# Altium project uVNA.PrjPcb (part 2 of 2)

## Sheet CodecA.SchDoc
size A4; SheetNumber: 10; SheetTotal: 14
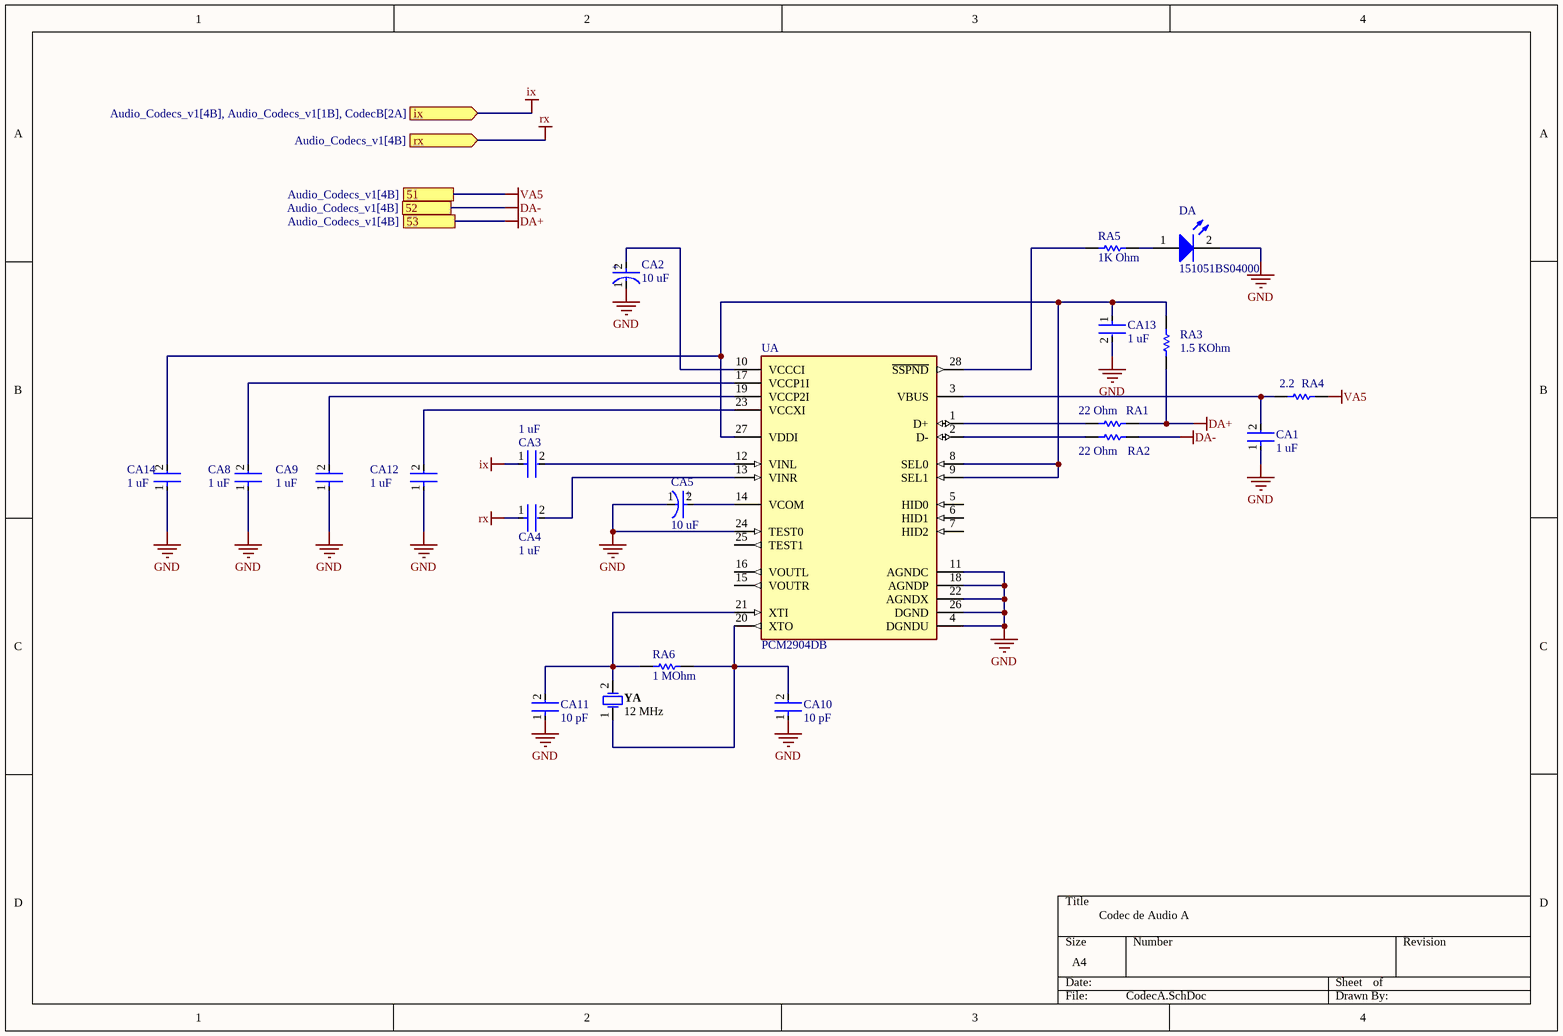
[diagram p10: CodecA.SchDoc]

### Parts
CA1  1 uF  [FP-CC0805-0_85-MFG]
CA2  10 uF  [FP-RAD-TH-D_6_3_0_5-L_7_1-MFG]
CA3  1 uF  [FP-CC0805-0_85-MFG]
CA4  1 uF  [FP-CC0805-0_85-MFG]
CA5  10 uF  [FP-RAD-TH-D_6_3_0_5-L_7_1-MFG]
CA8  1 uF  [FP-CC0805-0_85-MFG]
CA9  1 uF  [FP-CC0805-0_85-MFG]
CA10  10 pF  [FP-CC0805-0_85-MFG]
CA11  10 pF  [FP-CC0805-0_85-MFG]
CA12  1 uF  [FP-CC0805-0_85-MFG]
CA13  1 uF  [FP-CC0805-0_85-MFG]
CA14  1 uF  [FP-CC0805-0_85-MFG]
DA  151051BS04000  [WL-TMRC_D5.9H8.7]
RA1  22 Ohm  [RESC2013X60X40ML20T25]
RA2  22 Ohm  [RESC2013X60X40ML20T25]
RA3  1.5 KOhm  [RESC2013X60X40ML20T25]
RA4  2.2  [RESC2013X60X40ML20T25]
RA5  1K Ohm  [RESC2013X60X40ML20T25]
RA6  1 MOhm  [RESC2013X60X40ML20T25]
UA  PCM2904DB  [FP-DB0028A-IPC_A]
YA  12 MHz  [FOX-FOXSLF160-20]

### Ports
51 (see Audio_Codecs_v1[4B]), 52 (see Audio_Codecs_v1[4B]), 53 (see Audio_Codecs_v1[4B]), ix (in, see Audio_Codecs_v1[4B], Audio_Codecs_v1[1B], CodecB[2A]), rx (in, see Audio_Codecs_v1[4B])

### Nets
DA+: RA1.1 RA3.2 RA4.1 ; port 51, port 53  [also labelled VA5]
DA-: RA2.2 ; port 52
GND: CA1.1 CA2.1(C) CA5.1(C) CA8.1 CA9.1 CA10.1 CA11.1 CA12.1 CA13.2 CA14.1 DA.2(K) UA.4(DGNDU) UA.11(AGNDC) UA.18(AGNDP) UA.22(AGNDX) UA.24(TEST0) UA.26(DGND)
ix: CA3.1 ; port ix  [project net IF1]
rx: CA4.1 ; port rx
NetCA1_2: CA1.2 RA4.2 UA.3(VBUS)
NetCA2_2: CA2.2(A) UA.10(VCCCI)
NetCA3_2: CA3.2 UA.12(VINL)
NetCA4_2: CA4.2 UA.13(VINR)
NetCA5_2: CA5.2(A) UA.14(VCOM)
NetCA8_2: CA8.2 UA.17(VCCP1I)
NetCA9_2: CA9.2 UA.19(VCCP2I)
NetCA10_2: CA10.2 RA6.2 UA.20(XTO) YA.1
NetCA11_2: CA11.2 RA6.1 UA.21(XTI) YA.2
NetCA12_2: CA12.2 UA.23(VCCXI)
NetCA13_1: CA13.1 CA14.2 RA3.1 UA.8(SEL0) UA.9(SEL1) UA.27(VDDI)
NetDA_1: DA.1(A) RA5.1
NetRA1_2: RA1.2 UA.1(D+)
NetRA2_1: RA2.1 UA.2(D-)
NetRA5_2: RA5.2 UA.28(~{SSPND})

Not connected (* = marked no-connect by the designer): UA 5(HID0) 6(HID1) 7(HID2) 15(VOUTR) 16(VOUTL) 25(TEST1)

### Notes on the sheet
- Codec de Audio A
- (in symbol CMP-05427-001316-1) +

### Library data of the parts
CA1 CA3 CA4 CA8-CA14 = CMP-2100-03606-3: CAP CER 0.1UF 50V X7R 0805; Manufacturer Part Number: CC0805KRX7R9BB104; Manufacturer: Yageo; Tolerance: 0.1; Capacitance: 100 nF; Value: 100 nF; Device Class L1: Passive Components; ComponentLink2Description: Datasheet; Package: CC0805-0.85; Digikey Description: CAP CER 0.1UF 50V X7R 0805; Device Class L3: Ceramic Capacitors; Temperature: -30°C to +85°C; Temperature Characteristic: X7R; Voltage Rating: 50 V; Height: 0.95mm; RoHS: TRUE; Ipc Land Pattern Name: CAPC200125X85; Device Class L2: Capacitors; Category: Cap; Temperature Range Low: -30°C; Temperature Range High: +85°C; Material: Ceramic; Mouser Description: Multilayer Ceramic Capacitors MLCC - SMD/SMT 100nF 50V X7R 10%; Footprint Url: http://www.yageo.com/exep/pages/download/literatures/UPY-C_GEN_24.pdf; Automotive: No; Octopart: https://octopart.com/cc0805krx7r9bb104-yageo-192993; Lead Free: Yes; ComponentLink2URL: http://www.yageo.com/documents/recent/UPY-GPHC_Y5V_6.3V-to-50V_8.pdf
CA2 CA5 = CMP-05427-001316-1: Aluminum Electrolytic Capacitors (Radial Lead Type) 100uF ±20% 16V; Life (Hours): 1000Hour; Lead Diameter: 0.45mm; Polarity: Polar; Ripple Current: 91mA; Series: KA; Packaging: Tape and Reel; Voltage Rating: 16V; Voltage Rating (DC): 16V; Min Operating Temperature: -40°C; Lead Pitch: 2.5mm; Mount: Through Hole; Height - Seated (Max): 0.315inch; Package Quantity: 2000; Length: 7mm; Termination: Radial; Voltage: 16V; Diameter: 6.3mm; Height: 7mm; Radiation Hardening: No; RoHS Compliant: Yes; Tolerance: 20%; Capacitance: 100uF; Case/Package: Radial; Max Operating Temperature: 85°C
DA = CMP-1488-00009-2: NexarPartId: 29717812; Test Current: 20mA; Forward Voltage: 3.2V; Wavelength: 470nm; Lens Size: 5mm; Lens Style: Circular, Diffused, Round; Forward Current: 100mA; Peak Wavelength: 465nm; Viewing Angle: 40°; Luminous Intensity: 500mcd; Max Reverse Voltage (DC): 5V; Case/Package: Radial; Width: 5mm; Mount: Through Hole; Min Operating Temperature: -40°C; Length: 5mm; Height: 8.6mm; Max Operating Temperature: 85°C; Packaging: Bulk; Color: Blue; RoHS: Compliant; REACH SVHC: Unknown; Dominant Wavelength: 470nm
RA1-RA6 = CMP-2001-00580-1: Manufacturer: Panasonic; Part Number: ERA6AEB101V
UA = CMP-04873-000006-1: IC STEREO AUD CODEC W/USB 28SSOP; Max Supply Voltage: 5.25V; Number of Analog Outputs: 2; Operating Supply Voltage: 5V; Number of A/D Converters: 1; Min Supply Voltage: 3.25V; Resolution: 16b; Nominal Supply Current: 67mA; Number of Bits: 16; Sampling Rate: 48KS/s; Signal to Noise Ratio (SNR): 89dB; Interface: USB; Width: 5.3mm; Length: 10.2mm; Radiation Hardening: No; Weight: 0.010081oz; Height: 1.95mm; Mount: Surface Mount; Number of Analog Inputs: 2; RoHS Compliant: Yes; Lead Free: Lead Free; Number of DAC Channels: 2; Max Operating Temperature: 85°C; Number of Channels: 2; Number of Pins: 28; Packaging: Rail/Tube; Case/Package: SSOP; Number of ADC Channels: 2; Number of D/A Converters: 1; Min Operating Temperature: -25°C; Package Quantity: 47; Type: General Purpose
YA = CMP-1749-00003-1: Resistance Weld Thru-Hole Crystal, 16 MHz, -20 to 70 degC, 2-Pin THD, RoHS, Bulk; Voltage Rating: 250 V; Tolerance: 1%; Resistance: 221 kohm; Case\Package: Axial; Power Rating: 250 mW; RoHSCompliant: true; Package Quantity: 200; Packaging: Bulk; Min Operating Temperature: -55 degC; DatasheetVersion: Mar-15; ComponentLink1URL: http://www.foxonline.com/; Max Operating Temperature: 155 degC; PackageReference: FOXSLF160-20; Mount: Through Hole; PackageDescription: 2-Pin Through Hole Device, Body 11.35 x 4.65 mm; ComponentLink1Description: Manufacturer URL; ComponentLink2URL: http://www.foxonline.com/pdfs/hc49slf.pdf; ComponentLink2Description: Datasheet; Length: 0.248 inch

## Sheet CodecB.SchDoc
size A4; SheetNumber: 11; SheetTotal: 14
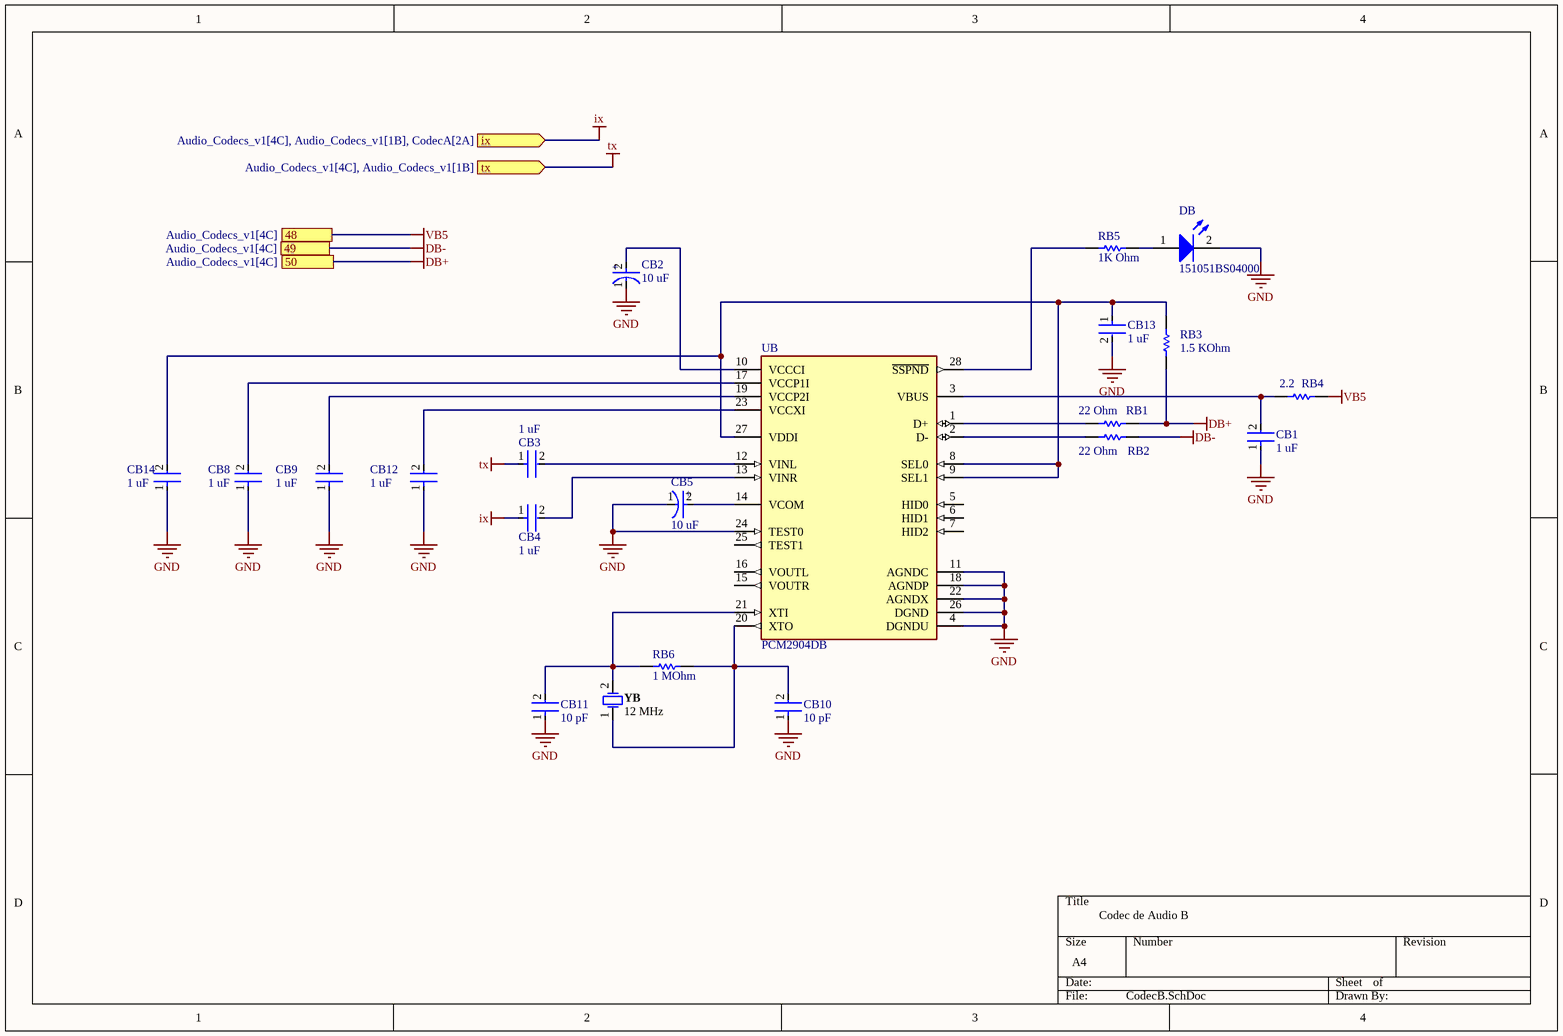
[diagram p11: CodecB.SchDoc]

### Parts
CB1  1 uF  [FP-CC0805-0_85-MFG]
CB2  10 uF  [FP-RAD-TH-D_6_3_0_5-L_7_1-MFG]
CB3  1 uF  [FP-CC0805-0_85-MFG]
CB4  1 uF  [FP-CC0805-0_85-MFG]
CB5  10 uF  [FP-RAD-TH-D_6_3_0_5-L_7_1-MFG]
CB8  1 uF  [FP-CC0805-0_85-MFG]
CB9  1 uF  [FP-CC0805-0_85-MFG]
CB10  10 pF  [FP-CC0805-0_85-MFG]
CB11  10 pF  [FP-CC0805-0_85-MFG]
CB12  1 uF  [FP-CC0805-0_85-MFG]
CB13  1 uF  [FP-CC0805-0_85-MFG]
CB14  1 uF  [FP-CC0805-0_85-MFG]
DB  151051BS04000  [WL-TMRC_D5.9H8.7]
RB1  22 Ohm  [RESC2013X60X40ML20T25]
RB2  22 Ohm  [RESC2013X60X40ML20T25]
RB3  1.5 KOhm  [RESC2013X60X40ML20T25]
RB4  2.2  [RESC2013X60X40ML20T25]
RB5  1K Ohm  [RESC2013X60X40ML20T25]
RB6  1 MOhm  [RESC2013X60X40ML20T25]
UB  PCM2904DB  [FP-DB0028A-IPC_A]
YB  12 MHz  [FOX-FOXSLF160-20]

### Ports
48 (see Audio_Codecs_v1[4C]), 49 (see Audio_Codecs_v1[4C]), 50 (see Audio_Codecs_v1[4C]), ix (in, see Audio_Codecs_v1[4C], Audio_Codecs_v1[1B], CodecA[2A]), tx (in, see Audio_Codecs_v1[4C], Audio_Codecs_v1[1B])

### Nets
DB+: RB1.1 RB3.2 ; port 50
DB-: RB2.2 ; port 49
GND: CB1.1 CB2.1(C) CB5.1(C) CB8.1 CB9.1 CB10.1 CB11.1 CB12.1 CB13.2 CB14.1 DB.2(K) UB.4(DGNDU) UB.11(AGNDC) UB.18(AGNDP) UB.22(AGNDX) UB.24(TEST0) UB.26(DGND)
ix: CB4.1 ; port ix  [project net IF1]
tx: CB3.1 ; port tx  [project net IF4]
VB5: RB4.1 ; port 48
NetCB1_2: CB1.2 RB4.2 UB.3(VBUS)
NetCB2_2: CB2.2(A) UB.10(VCCCI)
NetCB3_2: CB3.2 UB.12(VINL)
NetCB4_2: CB4.2 UB.13(VINR)
NetCB5_2: CB5.2(A) UB.14(VCOM)
NetCB8_2: CB8.2 UB.17(VCCP1I)
NetCB9_2: CB9.2 UB.19(VCCP2I)
NetCB10_2: CB10.2 RB6.2 UB.20(XTO) YB.1
NetCB11_2: CB11.2 RB6.1 UB.21(XTI) YB.2
NetCB12_2: CB12.2 UB.23(VCCXI)
NetCB13_1: CB13.1 CB14.2 RB3.1 UB.8(SEL0) UB.9(SEL1) UB.27(VDDI)
NetDB_1: DB.1(A) RB5.1
NetRB1_2: RB1.2 UB.1(D+)
NetRB2_1: RB2.1 UB.2(D-)
NetRB5_2: RB5.2 UB.28(~{SSPND})

Not connected (* = marked no-connect by the designer): UB 5(HID0) 6(HID1) 7(HID2) 15(VOUTR) 16(VOUTL) 25(TEST1)

### Notes on the sheet
- Codec de Audio B
- (in symbol CMP-05427-001316-1) +

### Library data of the parts
CB1 CB3 CB4 CB8-CB14 = CMP-2100-03606-3: as CA1 on sheet CodecA; Device Class L1: Passive Components; ComponentLink2Description: Datasheet; Package: CC0805-0.85; Digikey Description: CAP CER 0.1UF 50V X7R 0805; Device Class L3: Ceramic Capacitors; Temperature: -30°C to +85°C; Temperature Characteristic: X7R; Voltage Rating: 50 V; Height: 0.95mm; RoHS: TRUE; Ipc Land Pattern Name: CAPC200125X85; Device Class L2: Capacitors; Category: Cap; Temperature Range Low: -30°C; Temperature Range High: +85°C; Material: Ceramic; Mouser Description: Multilayer Ceramic Capacitors MLCC - SMD/SMT 100nF 50V X7R 10%; Footprint Url: http://www.yageo.com/exep/pages/download/literatures/UPY-C_GEN_24.pdf; Automotive: No; Octopart: https://octopart.com/cc0805krx7r9bb104-yageo-192993; Lead Free: Yes; ComponentLink2URL: http://www.yageo.com/documents/recent/UPY-GPHC_Y5V_6.3V-to-50V_8.pdf
CB2 CB5 = CMP-05427-001316-1: as CA2 on sheet CodecA; Series: KA; Packaging: Tape and Reel; Voltage Rating: 16V; Voltage Rating (DC): 16V; Min Operating Temperature: -40°C; Lead Pitch: 2.5mm; Mount: Through Hole; Height - Seated (Max): 0.315inch; Package Quantity: 2000; Length: 7mm; Termination: Radial; Voltage: 16V; Diameter: 6.3mm; Height: 7mm; Radiation Hardening: No; RoHS Compliant: Yes; Tolerance: 20%; Capacitance: 100uF; Case/Package: Radial; Max Operating Temperature: 85°C
DB = CMP-1488-00009-2: as DA on sheet CodecA; Case/Package: Radial; Width: 5mm; Mount: Through Hole; Min Operating Temperature: -40°C; Length: 5mm; Height: 8.6mm; Max Operating Temperature: 85°C; Packaging: Bulk; Color: Blue; RoHS: Compliant; REACH SVHC: Unknown; Dominant Wavelength: 470nm
RB1-RB6 = CMP-2001-00580-1: as RA1 on sheet CodecA
UB = CMP-04873-000006-1: as UA on sheet CodecA; Width: 5.3mm; Length: 10.2mm; Radiation Hardening: No; Weight: 0.010081oz; Height: 1.95mm; Mount: Surface Mount; Number of Analog Inputs: 2; RoHS Compliant: Yes; Lead Free: Lead Free; Number of DAC Channels: 2; Max Operating Temperature: 85°C; Number of Channels: 2; Number of Pins: 28; Packaging: Rail/Tube; Case/Package: SSOP; Number of ADC Channels: 2; Number of D/A Converters: 1; Min Operating Temperature: -25°C; Package Quantity: 47; Type: General Purpose
YB = CMP-1749-00003-1: as YA on sheet CodecA; RoHSCompliant: true; Package Quantity: 200; Packaging: Bulk; Min Operating Temperature: -55 degC; DatasheetVersion: Mar-15; ComponentLink1URL: http://www.foxonline.com/; Max Operating Temperature: 155 degC; PackageReference: FOXSLF160-20; Mount: Through Hole; PackageDescription: 2-Pin Through Hole Device, Body 11.35 x 4.65 mm; ComponentLink1Description: Manufacturer URL; ComponentLink2URL: http://www.foxonline.com/pdfs/hc49slf.pdf; ComponentLink2Description: Datasheet; Length: 0.248 inch

## Sheet PIC18F4550.SchDoc
size A4; SheetNumber: 5; SheetTotal: 13
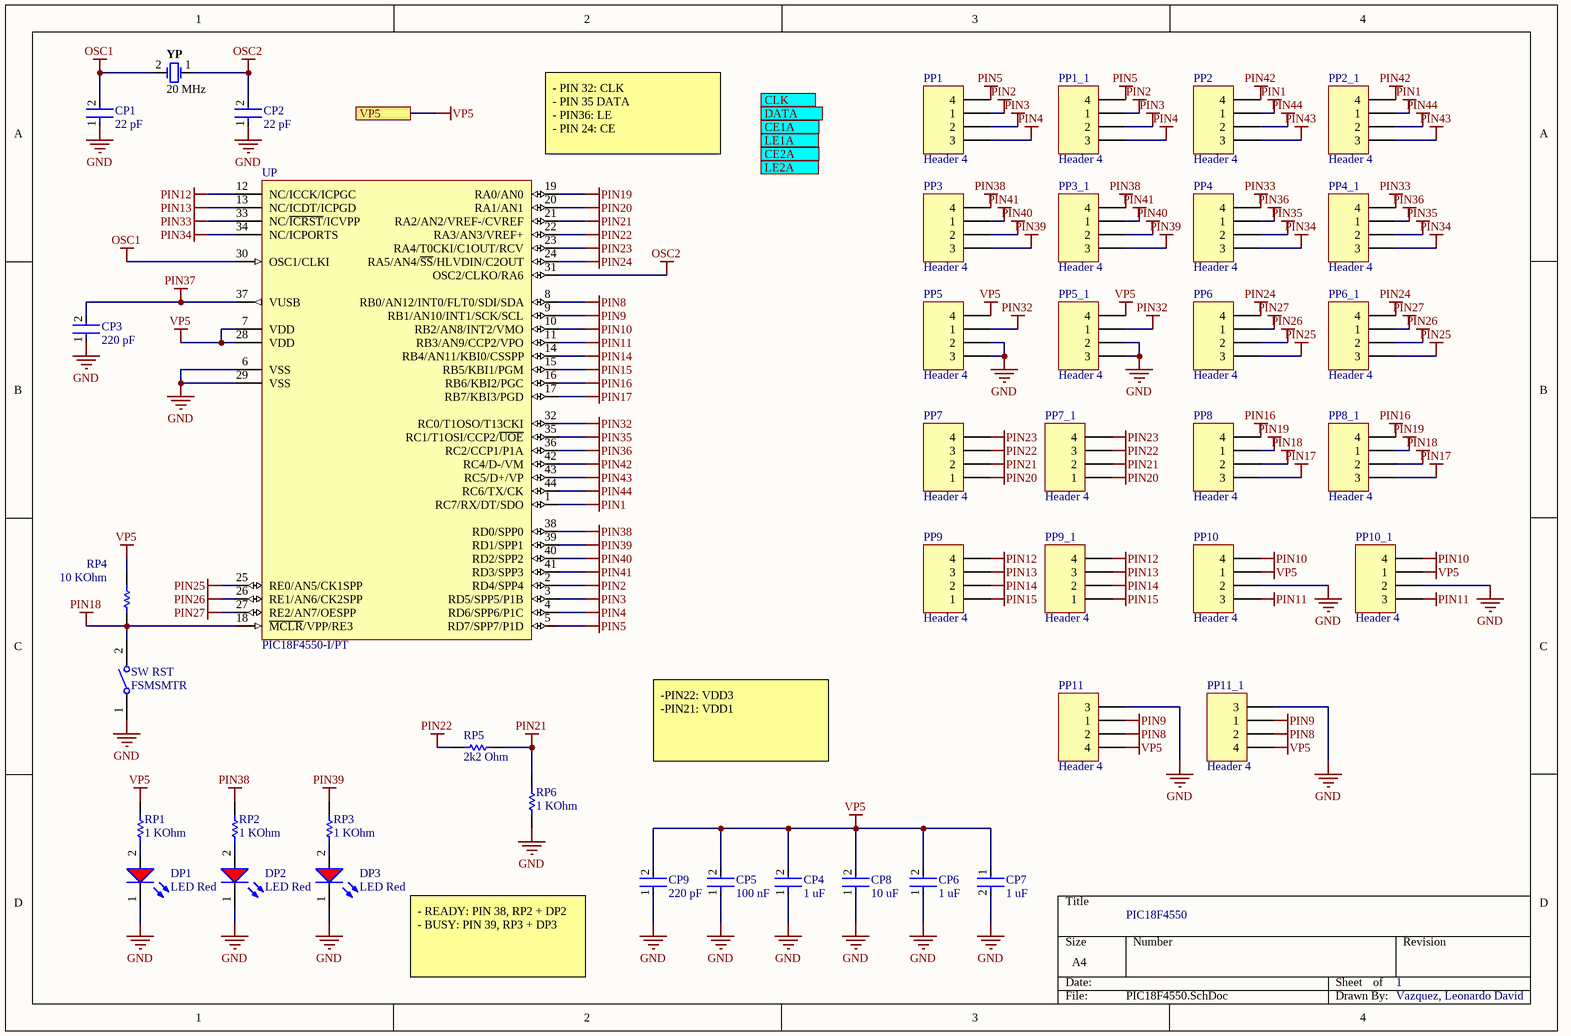
[diagram p12: PIC18F4550.SchDoc]

### Parts
CP1  22 pF  [FP-CC0805-0_85-MFG]
CP2  22 pF  [FP-CC0805-0_85-MFG]
CP3  220 pF  [FP-CC0805-0_85-MFG]
CP4  1 uF  [FP-CC0805-0_85-MFG]
CP5  100 nF  [FP-CC0805-0_85-MFG]
CP6  1 uF  [FP-CC0805-0_85-MFG]
CP7  1 uF  [FP-CC0805-0_85-MFG]
CP8  10 uF  [FP-CC0805-0_85-MFG]
CP9  220 pF  [FP-CC0805-0_85-MFG]
DP1  LED Red  [WL-SMCW_0805_150080xx75000]
DP2  LED Red  [WL-SMCW_0805_150080xx75000]
DP3  LED Red  [WL-SMCW_0805_150080xx75000]
PP1  Header 4  [HDR1X4]
PP1_1  Header 4  [HDR1X4]
PP2  Header 4  [HDR1X4]
PP2_1  Header 4  [HDR1X4]
PP3  Header 4  [HDR1X4]
PP3_1  Header 4  [HDR1X4]
PP4  Header 4  [HDR1X4]
PP4_1  Header 4  [HDR1X4]
PP5  Header 4  [HDR1X4]
PP5_1  Header 4  [HDR1X4]
PP6  Header 4  [HDR1X4]
PP6_1  Header 4  [HDR1X4]
PP7  Header 4  [HDR1X4]
PP7_1  Header 4  [HDR1X4]
PP8  Header 4  [HDR1X4]
PP8_1  Header 4  [HDR1X4]
PP9  Header 4  [HDR1X4]
PP9_1  Header 4  [HDR1X4]
PP10  Header 4  [HDR1X4]
PP10_1  Header 4  [HDR1X4]
PP11  Header 4  [HDR1X4]
PP11_1  Header 4  [HDR1X4]
RP1  1 KOhm  [RESC2013X60X40ML20T25]
RP2  1 KOhm  [RESC2013X60X40ML20T25]
RP3  1 KOhm  [RESC2013X60X40ML20T25]
RP4  10 KOhm  [RESC2013X60X40ML20T25]
RP5  2k2 Ohm  [RESC2013X60X40ML20T25]
RP6  1 KOhm  [RESC2013X60X40ML20T25]
SW_RST  FSMSMTR  [TECO-FSMSMTR_V]
UP  PIC18F4550-I/PT  [TQFP-PT44_M]
YP  20 MHz  [FOX-FOXSLF160-20]

### Ports
CE1A (out, see uVNA[1B], ADF4351_10X2_v1[1D], Data_converter[1A]), CE2A (out, see uVNA[1B], ADF4351_10X2_v1[1D], Data_converter[3A]), CLK (out, see uVNA[1B], ADF4351_10X2_v1[1D]), DATA (out, see uVNA[1B], ADF4351_10X2_v1[1D]), LE1A (out, see uVNA[1B], ADF4351_10X2_v1[1D], Data_converter[1C]), LE2A (out, see uVNA[1B], ADF4351_10X2_v1[1D], Data_converter[3C]), VP5 (see uVNA[1A])

### Nets
GND: CP1.1 CP2.1 CP3.1 CP4.1 CP5.1 CP6.1 CP7.2 CP8.1 CP9.1 DP1.1(K) DP2.1(K) DP3.1(K) PP5.2 PP5.3 PP5_1.2 PP5_1.3 PP10.2 PP10_1.2 PP11.3 PP11_1.3 RP6.1 SW_RST.1 UP.6(VSS) UP.29(VSS)
OSC1: CP1.2 UP.30(OSC1/CLKI) YP.2
OSC2: CP2.2 UP.31(OSC2/CLKO/RA6) YP.1
PIN1: PP2.1 PP2_1.1 UP.1(RC7/RX/DT/SDO)
PIN2: PP1.1 PP1_1.1 UP.2(RD4/SPP4)
PIN3: PP1.2 PP1_1.2 UP.3(RD5/SPP5/P1B)
PIN4: PP1.3 PP1_1.3 UP.4(RD6/SPP6/P1C)
PIN5: PP1.4 PP1_1.4 UP.5(RD7/SPP7/P1D)
PIN8: PP11.2 PP11_1.2 UP.8(RB0/AN12/INT0/FLT0/SDI/SDA)
PIN9: PP11.1 PP11_1.1 UP.9(RB1/AN10/INT1/SCK/SCL)
PIN10: PP10.4 PP10_1.4 UP.10(RB2/AN8/INT2/VMO)
PIN11: PP10.3 PP10_1.3 UP.11(RB3/AN9/CCP2/VPO)
PIN12: PP9.4 PP9_1.4 UP.12(NC/ICCK/ICPGC)
PIN13: PP9.3 PP9_1.3 UP.13(NC/ICDT/ICPGD)
PIN14: PP9.2 PP9_1.2 UP.14(RB4/AN11/KBI0/CSSPP)
PIN15: PP9.1 PP9_1.1 UP.15(RB5/KBI1/PGM)
PIN16: PP8.4 PP8_1.4 UP.16(RB6/KBI2/PGC)
PIN17: PP8.3 PP8_1.3 UP.17(RB7/KBI3/PGD)
PIN18: PP8.2 PP8_1.2 RP4.1 SW_RST.2 UP.18(~{MCLR}/VPP/RE3)
PIN19: PP8.1 PP8_1.1 UP.19(RA0/AN0)
PIN20: PP7.1 PP7_1.1 UP.20(RA1/AN1)
PIN21: PP7.2 PP7_1.2 RP5.1 RP6.2 UP.21(RA2/AN2/VREF-/CVREF)
PIN22: PP7.3 PP7_1.3 RP5.2 UP.22(RA3/AN3/VREF+)
PIN23: PP7.4 PP7_1.4 UP.23(RA4/T0CKI/C1OUT/RCV)
PIN24: PP6.4 PP6_1.4 UP.24(RA5/AN4/~{SS}/HLVDIN/C2OUT)
PIN25: PP6.3 PP6_1.3 UP.25(RE0/AN5/CK1SPP)
PIN26: PP6.2 PP6_1.2 UP.26(RE1/AN6/CK2SPP)
PIN27: PP6.1 PP6_1.1 UP.27(RE2/AN7/OESPP)
PIN32: PP5.1 PP5_1.1 UP.32(RC0/T1OSO/T13CKI)
PIN33: PP4.4 PP4_1.4 UP.33(NC/~{ICRST}/ICVPP)
PIN34: PP4.3 PP4_1.3 UP.34(NC/ICPORTS)
PIN35: PP4.2 PP4_1.2 UP.35(RC1/T1OSI/CCP2/~{UOE})
PIN36: PP4.1 PP4_1.1 UP.36(RC2/CCP1/P1A)
PIN37: CP3.2 UP.37(VUSB)
PIN38: PP3.4 PP3_1.4 RP2.2 UP.38(RD0/SPP0)
PIN39: PP3.3 PP3_1.3 RP3.2 UP.39(RD1/SPP1)
PIN40: PP3.2 PP3_1.2 UP.40(RD2/SPP2)
PIN41: PP3.1 PP3_1.1 UP.41(RD3/SPP3)
PIN42: PP2.4 PP2_1.4 UP.42(RC4/D-/VM)
PIN43: PP2.3 PP2_1.3 UP.43(RC5/D+/VP)
PIN44: PP2.2 PP2_1.2 UP.44(RC6/TX/CK)
VP5: CP4.2 CP5.2 CP6.2 CP7.1 CP8.2 CP9.2 PP5.4 PP5_1.4 PP10.1 PP10_1.1 PP11.4 PP11_1.4 RP1.2 RP4.2 UP.7(VDD) UP.28(VDD) ; port VP5
NetDP1_2: DP1.2(A) RP1.1
NetDP2_2: DP2.2(A) RP2.1
NetDP3_2: DP3.2(A) RP3.1

### Notes on the sheet
- (near UP) - PIN 32: CLK
  - PIN 35 DATA
  - PIN36: LE
  - PIN 24: CE
- -PIN22: VDD3
  -PIN21: VDD1
- PIC18F4550
- - READY: PIN 38, RP2 + DP2
  - BUSY: PIN 39, RP3 + DP3
- 1
- Vazquez, Leonardo David

### Library data of the parts
CP1-CP4 CP6-CP9 = CMP-2100-03606-3: as CA1 on sheet CodecA; Device Class L1: Passive Components; ComponentLink2Description: Datasheet; Package: CC0805-0.85; Digikey Description: CAP CER 0.1UF 50V X7R 0805; Device Class L3: Ceramic Capacitors; Temperature: -30°C to +85°C; Temperature Characteristic: X7R; Voltage Rating: 50 V; Height: 0.95mm; RoHS: TRUE; Ipc Land Pattern Name: CAPC200125X85; Device Class L2: Capacitors; Category: Cap; Temperature Range Low: -30°C; Temperature Range High: +85°C; Material: Ceramic; Mouser Description: Multilayer Ceramic Capacitors MLCC - SMD/SMT 100nF 50V X7R 10%; Footprint Url: http://www.yageo.com/exep/pages/download/literatures/UPY-C_GEN_24.pdf; Automotive: No; Octopart: https://octopart.com/cc0805krx7r9bb104-yageo-192993; Lead Free: Yes; ComponentLink2URL: http://www.yageo.com/documents/recent/UPY-GPHC_Y5V_6.3V-to-50V_8.pdf
CP5 = CMP-2100-03606-3: CAP CER 0.1UF 50V X7R 0805; Manufacturer Part Number: CC0805KRX7R9BB104; Manufacturer: Yageo; Tolerance: 0.1; Device Class L1: Passive Components; ComponentLink2Description: Datasheet; Package: CC0805-0.85; Digikey Description: CAP CER 0.1UF 50V X7R 0805; Capacitance: 100 nF; Device Class L3: Ceramic Capacitors; Value: 100 nF; Temperature: -30°C to +85°C; Temperature Characteristic: X7R; Voltage Rating: 50 V; Height: 0.95mm; RoHS: TRUE; Ipc Land Pattern Name: CAPC200125X85; Device Class L2: Capacitors; Category: Cap; Temperature Range Low: -30°C; Temperature Range High: +85°C; Material: Ceramic; Mouser Description: Multilayer Ceramic Capacitors MLCC - SMD/SMT 100nF 50V X7R 10%; Footprint Url: http://www.yageo.com/exep/pages/download/literatures/UPY-C_GEN_24.pdf; Automotive: No; Octopart: https://octopart.com/cc0805krx7r9bb104-yageo-192993; Lead Free: Yes; ComponentLink2URL: http://www.yageo.com/documents/recent/UPY-GPHC_Y5V_6.3V-to-50V_8.pdf
DP1-DP3 = CMP-1426-00011-2: NexarPartId: 29717781; Peak Wavelength: 630nm; Wavelength: 625nm; Viewing Angle: 140°; Test Current: 20mA; Forward Voltage: 2V; Forward Current: 100mA; Lens Style: Clear, Rectangular; Luminous Intensity: 150mcd; Max Reverse Voltage (DC): 5V; Length: 2mm; Case Code (Imperial): 0805; RoHS: Compliant; Max Operating Temperature: 85°C; Height: 700µm; Packaging: Tape and Reel; Color: Red; Case/Package: 0805; REACH SVHC: Unknown; Dominant Wavelength: 625nm; Min Operating Temperature: -40°C; Case Code (Metric): 2012; Mount: Surface Mount; Width: 1.25mm
PP1 PP1_1 PP2 PP2_1 PP3 PP3_1 PP4 PP4_1 PP5 PP5_1 PP6 PP6_1 PP7 PP7_1 PP8 PP8_1 PP9 PP9_1 PP10 PP10_1 PP11 PP11_1 = Header 4: Header, 4-Pin; LatestRevisionDate: 17-Jul-2002; LatestRevisionNote: Re-released for DXP Platform.; Publisher: Altium Limited
RP1-RP6 = CMP-2001-00580-1: as RA1 on sheet CodecA
SW_RST = CMP-2000-07501-1: FSMSM Push Button Switch, 50 mA, -35 to 85 degC, 2-Pin SMD, RoHS, Tape and Reel; Manufacturer: TE Connectivity; Voltage Rating (DC): 24V; Electrical Life: 20000Cycles; Operating Force: 180gf; Switch Travel: 0.25mm; Contact Current Rating: 50mA; Case\/Package: SMD/SMT; Actuator Length: 1.07mm; Throw Configuration: SPST; Actuator Material: Polyamide; Contact Resistance: 100mOhm; Illumination Type: Illuminated; Max Voltage Rating (DC): 12V; Manufacturer URL: http://www.te.com/; Lead Free: LeadFree; Packaging: TapeandReel; Min Operating Temperature: -35degC; Mechanical Life: 20000Cycles; Mount: SurfaceMount; REACH SVHC: Unknown; Package Quantity: 1800; Package Reference: FSMSMTR; RoHSCompliant: true; Max Operating Temperature: 85degC; Orientation: Straight; ELV: Compliant; Datasheet URL: http://www.te.com/commerce/DocumentDelivery/DDEController?Action=showdoc&DocId=Customer+Drawing%7F1437566-3%7FC2%7Fpdf%7FEnglish%7FENG_CD_1437566-3_C2_1437566_3_1_c.dwg.pdf%7F1437566-4; Package Description: 2-Pin Surface Mount Device, Body 6 x 3.5 mm, Pitch 9.19 mm; Current Rating: 50mA; Contact Plating: Silver; Termination: GullWing; Datasheet Version: Rev. C2, 08/2014; Contact Material: Brass; Mounting Technology: SurfaceMount
UP = CMP-0116-00956-1: High Performance, Enhanced Flash, USB Microcontroller with nanoWatt Technology, 32K Flash, 44-Pin TQFP, Industrial Temperature Range; Code_JEDEC: MS-026; PackageReference: TQFP-PT44; DatasheetVersion: revE, Aug-2008; PackageDescription: 44-Lead Plastic Thin Quad Flatpack (PT) - 10x10x1mm Body, 2.00mm [TQFP]; PackageVersion: revBB, Aug-2009
YP = CMP-1749-00003-1: as YA on sheet CodecA; RoHSCompliant: true; Package Quantity: 200; Packaging: Bulk; Min Operating Temperature: -55 degC; DatasheetVersion: Mar-15; ComponentLink1URL: http://www.foxonline.com/; Max Operating Temperature: 155 degC; PackageReference: FOXSLF160-20; Mount: Through Hole; PackageDescription: 2-Pin Through Hole Device, Body 11.35 x 4.65 mm; ComponentLink1Description: Manufacturer URL; ComponentLink2URL: http://www.foxonline.com/pdfs/hc49slf.pdf; ComponentLink2Description: Datasheet; Length: 0.248 inch

## Nets that join several sheets
AVDD1: ADF4351_10X2_v1 (C05.2 U4.3), Sintetizador1 (31 pins), Sintetizador2 (29 pins), Data_converter (R43.2 R48.2 R413.2 R419.2)
CE1: Sintetizador1 (U1.4), Data_converter (R42.1 R43.1)
CE1A: ADF4351_10X2_v1 (P2.1 P3.4), Data_converter (R42.2)
CE2: Sintetizador2 (U2.4), Data_converter (R418.1 R419.1)
CE2A: ADF4351_10X2_v1 (P5.4), Data_converter (R418.2)
CLK1: Sintetizador1 (U1.1), Data_converter (R44.1 R45.2)
CLK1A: ADF4351_10X2_v1 (P2.4 P3.1 P5.1), Data_converter (R44.2 R417.2)
CLK2: Sintetizador2 (U2.1), Data_converter (R416.2 R417.1)
DA+: uVNA (JA.1 JA.3), CodecA (RA1.1 RA3.2 RA4.1)
DA-: uVNA (JA.2), CodecA (RA2.2)
DATA1: Sintetizador1 (U1.2), Data_converter (R46.1 R47.2)
DATA1A: ADF4351_10X2_v1 (P2.3 P3.2 P5.2), Data_converter (R46.2 R415.2)
DATA2: Sintetizador2 (U2.2), Data_converter (R414.2 R415.1)
DB+: uVNA (JB.3), CodecB (RB1.1 RB3.2)
DB-: uVNA (JB.2), CodecB (RB2.2)
GND: uVNA (8 pins), ADF4351_10X2_v1 (10 pins), oscilador_10MHz (6 pins), Sintetizador1 (36 pins), Sintetizador2 (36 pins), Data_converter (6 pins), RR_MXR_v1 (12 pins), PuenteR (5 pins), Mixers (16 pins), Audio_Codecs_v1 (13 pins), CodecA (17 pins), CodecB (17 pins), PIC18F4550 (24 pins)
IF1: RR_MXR_v1 (PM1.2), Mixers (CM13.2 RM1.1), Audio_Codecs_v1 (PC2.1), CodecA (CA3.1), CodecB (CB4.1)
IF2: RR_MXR_v1 (PM2.2), Mixers (CM23.2 RM2.1), Audio_Codecs_v1 (CC2.2 PC1.3)
IF3: RR_MXR_v1 (PM3.2), Mixers (CM33.2 RM3.1), Audio_Codecs_v1 (CC1.2 PC1.2)
IF4: RR_MXR_v1 (PM4.2), Mixers (CM43.2 RM4.1), Audio_Codecs_v1 (PC2.3), CodecB (CB3.1)
LE1: Sintetizador1 (U1.3), Data_converter (R48.1 R49.1 R410.2)
LE1A: ADF4351_10X2_v1 (P2.2 P3.3), Data_converter (R49.2)
LE2: Sintetizador2 (U2.3), Data_converter (R411.2 R412.1 R413.1)
LE2A: ADF4351_10X2_v1 (P5.3), Data_converter (R412.2)
Pfwd: PuenteR (RR2A.1 RR3.1), Mixers (CM12.1)
Pin: ADF4351_10X2_v1 (J2.1), Sintetizador2 (C227.2), RR_MXR_v1 (JM1.1), PuenteR (RR2A.2 RR4A.2)
Prev1: PuenteR (RR9.1 RR10.1), Mixers (CM32.1)
Prev2: PuenteR (RR12.1 RR13.1), Mixers (CM22.1)
REFF: oscilador_10MHz (C04.2), Sintetizador1 (C121.1), Sintetizador2 (C221.1)
RF1: ADF4351_10X2_v1 (J1.1), Sintetizador1 (C127.2), RR_MXR_v1 (JM3.1), Mixers (R55.2)
rx: Audio_Codecs_v1 (RC4.1 UC.6), CodecA (CA4.1)
TMX: uVNA (JM4.1), Mixers (CM42.1)
V5: ADF4351_10X2_v1 (C06.2 P1.2 R41.2 U4.1), oscilador_10MHz (R01.2)
VB5: uVNA (JB.1), CodecB (RB4.1)
VM5: RR_MXR_v1 (CM15.1 PM5.2 PM6.2 RM6.2), Mixers (8 pins)
ZL: uVNA (JM2.1), PuenteR (RR6A.1 RR8A.1 RR9.2)